# EAGLE design MySensors_PIR (EAGLE 7.2.0)
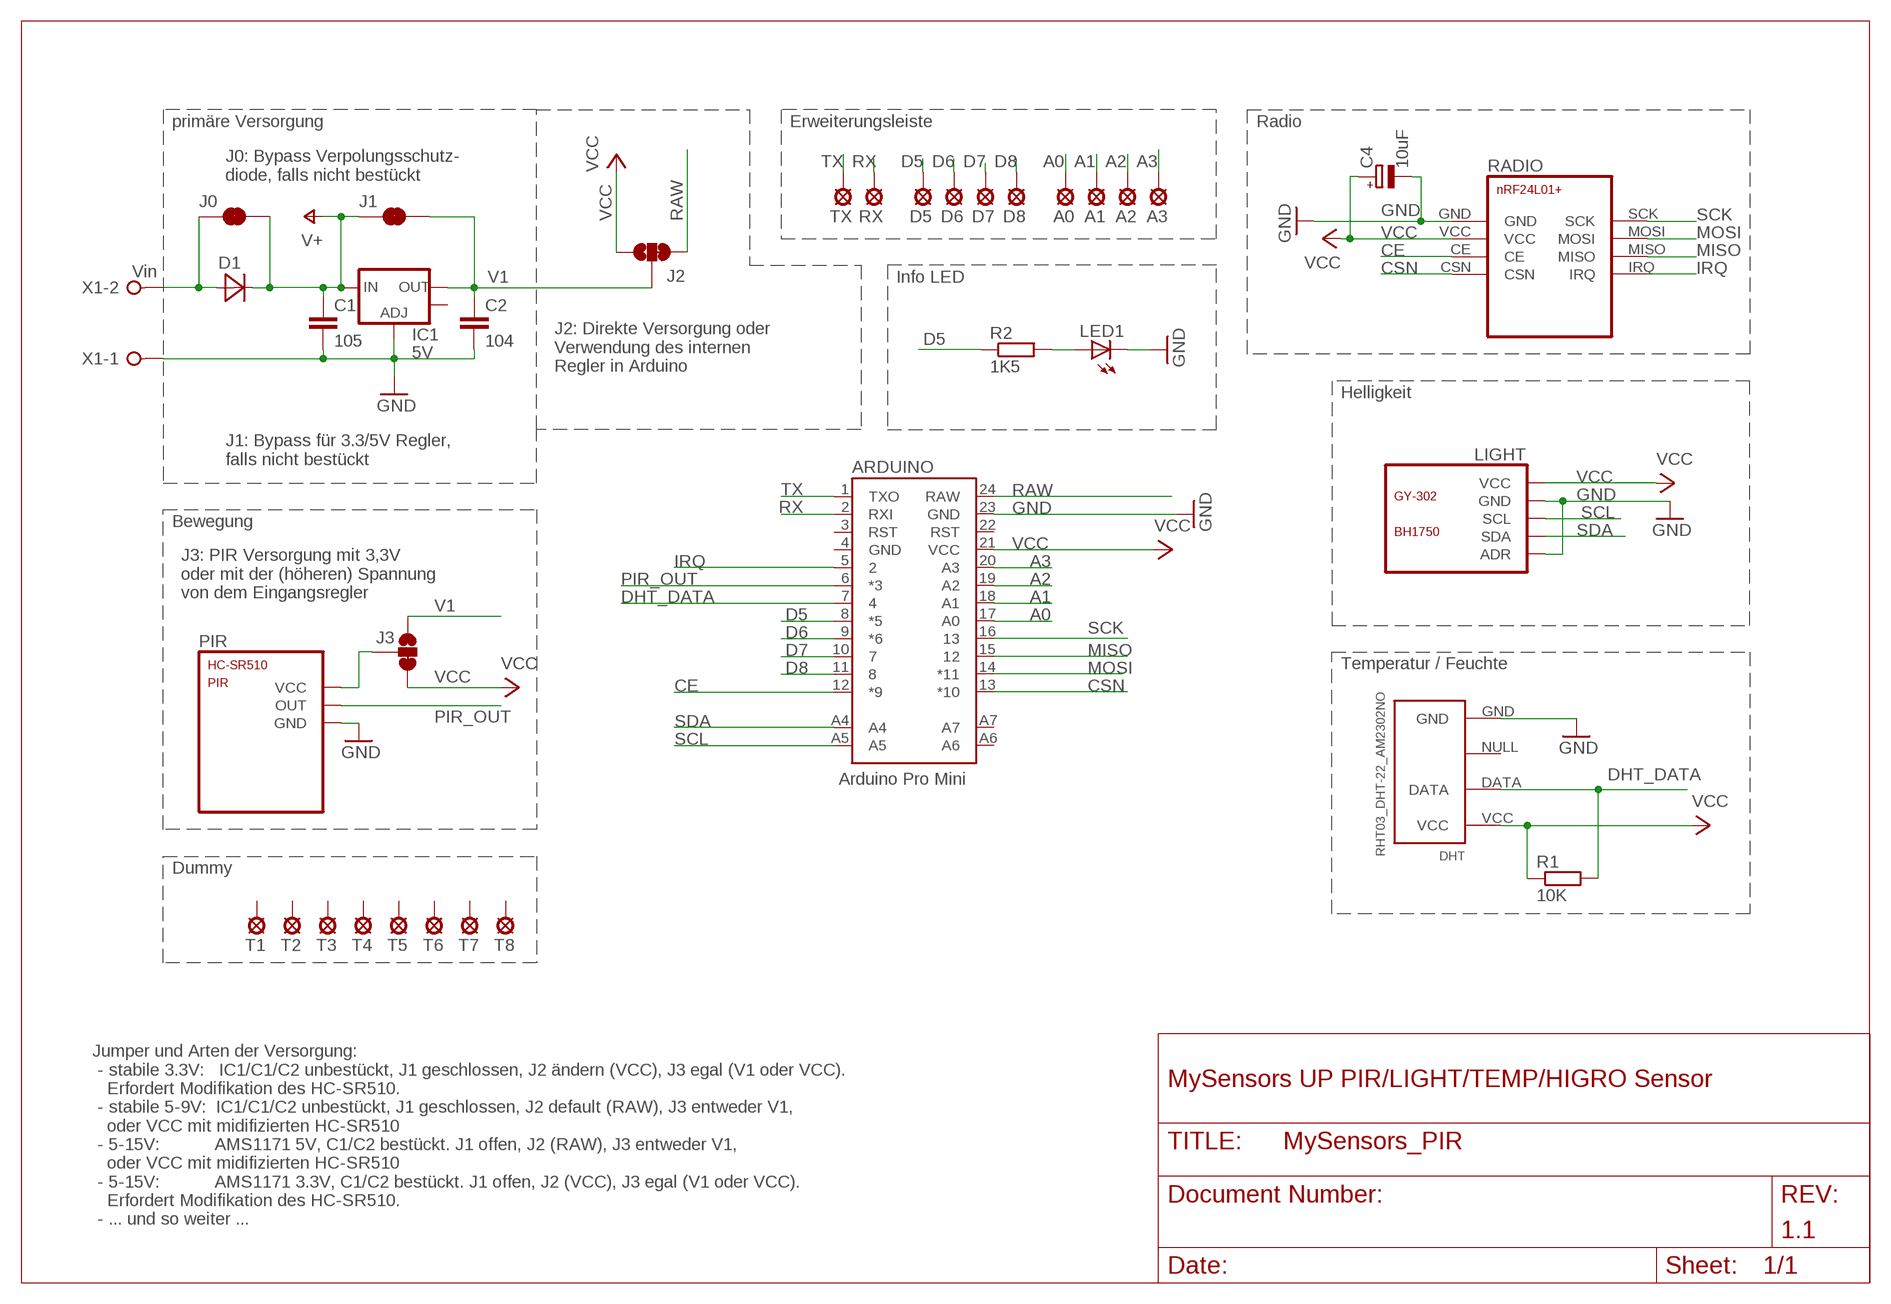
[diagram p0: schematic, sheet 1]

## Parts
A0  LSP10  [LSP10]
A1  LSP10  [LSP10]
A2  LSP10  [LSP10]
A3  LSP10  [LSP10]
ARDUINO  ARDUINO_PRO_MININO  [ARDUINO_PRO_MINI_O]
C1  105  C-EU025-025X050  [C025-025X050]
C2  104  C-EU025-025X050  [C025-025X050]
C4  10uF  CPOL-EUE2,5-6E  [E2,5-6E]
D1  DIODE2.5U  [DIODE2.5U]
D5  LSP10  [LSP10]
D6  LSP10  [LSP10]
D7  LSP10  [LSP10]
D8  LSP10  [LSP10]
DHT  RHT03_DHT-22_AM2302NO  [RHT03_DHT-22/RA_O]
IC1  5V  V_REG_LM1117SOT223  [SOT223]
J0  JUMPER-PAD-2-NC_BY_TRACE  [PAD-JUMPER-2-NC_BY_TRACE_YES_SILK]
J1  JUMPER-PAD-2-NC_BY_TRACE  [PAD-JUMPER-2-NC_BY_TRACE_YES_SILK]
J2  JUMPER-PAD-3-2OF3_NC_BY_TRACE_SMALL  [PAD-JUMPER-3-2OF3_NC_BY_TRACE_YES_SILK_FULL_BOX]
J3  JUMPER-PAD-3-2OF3_NC_BY_TRACE_SMALL  [PAD-JUMPER-3-2OF3_NC_BY_TRACE_YES_SILK_FULL_BOX]
LED1  UNI_LED_3MM+SMD  [LED3MM]
LIGHT  GY-302  [GY-302]
PIR  HC-SR501  [HC-SR501]
R1  10K  R-EU_0204/2V  [0204V]
R2  1K5  R-EU_0204/2V  [0204V]
RADIO  NRF24L01+  [NRF24L01+]
RX  LSP10  [LSP10]
T1  LSP10  [LSP10]
T2  LSP10  [LSP10]
T3  LSP10  [LSP10]
T4  LSP10  [LSP10]
T5  LSP10  [LSP10]
T6  LSP10  [LSP10]
T7  LSP10  [LSP10]
T8  LSP10  [LSP10]
TX  LSP10  [LSP10]
X1  Vin  W237-02P  [W237-132]

## Nets
A0: A0.1(MP) ARDUINO.17(A0)
A1: A1.1(MP) ARDUINO.18(A1)
A2: A2.1(MP) ARDUINO.19(A2)
A3: A3.1(MP) ARDUINO.20(A3)
CE: ARDUINO.12(*9) RADIO.CE
CSN: ARDUINO.13(*10) RADIO.CSN
D5: ARDUINO.8(*5) D5.1(MP) R2.1
D6: ARDUINO.9(*6) D6.1(MP)
D7: ARDUINO.10 D7.1(MP)
D8: ARDUINO.11 D8.1(MP)
DHT_DATA: ARDUINO.7 DHT.DATA R1.2
GND: ARDUINO.23(GND) C1.2 C2.2 C4.- DHT.GND IC1.1(ADJ) LED1.K(C) LIGHT.ADR LIGHT.GND PIR.GND RADIO.GND X1.1
IRQ: ARDUINO.5 RADIO.IRQ
MISO: ARDUINO.15 RADIO.MISO
MOSI: ARDUINO.14(*11) RADIO.MOSI
N$4: LED1.A R2.2
N$5: D1.A J0.1 X1.2
PIR_OUT: ARDUINO.6(*3) PIR.OUT
PIR_VCC: J3.2 PIR.VCC
RAW: ARDUINO.24(RAW) J2.3
RX: ARDUINO.2(RXI) RX.1(MP)
SCK: ARDUINO.16 RADIO.SCK
SCL: ARDUINO.A5 LIGHT.SCL
SDA: ARDUINO.A4 LIGHT.SDA
TX: ARDUINO.1(TXO) TX.1(MP)
V1: C2.1 IC1.2(OUT) J1.2 J2.2 J3.1
V+: C1.1 D1.K(C) IC1.3(IN) J0.2 J1.1
VCC: ARDUINO.21(VCC) C4.+ DHT.VCC J2.1 J3.3 LIGHT.VCC R1.1 RADIO.VCC
Unconnected: ARDUINO.3(RST) ARDUINO.4(GND) ARDUINO.22(RST) ARDUINO.A6 ARDUINO.A7 DHT.NULL IC1.4(OUT) T1.1(MP) T2.1(MP) T3.1(MP) T4.1(MP) T5.1(MP) T6.1(MP) T7.1(MP) T8.1(MP)

## Notes on the sheet
- primäre Versorgung | Erweiterungsleiste | Radio
- J0: Bypass Verpolungsschutz-
  diode, falls nicht bestückt
- Info LED
- J2: Direkte Versorgung oder 
  Verwendung des internen 
  Regler in Arduino
- Helligkeit
- J1: Bypass für 3.3/5V Regler, 
  falls nicht bestückt
- Bewegung
- J3: PIR Versorgung mit 3,3V 
  oder mit der (höheren) Spannung
  von dem Eingangsregler
- Temperatur / Feuchte
- Arduino Pro Mini
- Dummy
- MySensors UP PIR/LIGHT/TEMP/HIGRO Sensor
- Jumper und Arten der Versorgung:
   - stabile 3.3V:   IC1/C1/C2 unbestückt, J1 geschlossen, J2 ändern (VCC), J3 egal (V1 oder VCC). 
     Erfordert Modifikation des HC-SR510.
   - stabile 5-9V:  IC1/C1/C2 unbestückt, J1 geschlossen, J2 default (RAW), J3 entweder V1, 
     oder VCC mit midifizierten HC-SR510
   - 5-15V:           AMS1171 5V, C1/C2 bestückt. J1 offen, J2 (RAW), J3 entweder V1, 
     oder VCC mit midifizierten HC-SR510
   - 5-15V:           AMS1171 3.3V, C1/C2 bestückt. J1 offen, J2 (VCC), J3 egal (V1 oder VCC). 
     Erfordert Modifikation des HC-SR510.
   - ... und so weiter ...
- 1.1

## Library data of the parts
A0 A1-A3 D5-D8 RX T1-T8 TX = my:LSP10: SOLDER PAD drill 1.0 mm, distributor Buerklin, 12H555
ARDUINO = my:ARDUINO_PRO_MINI
C1 C2 = resistor:C-EU: CAPACITOR, European symbol
C4 = rcl:CPOL-EU: POLARIZED CAPACITOR, European symbol
D1 = my:DIODE2.5U
DHT = my:RHT03_DHT-22_AM2302: RHT03 / DHT-22 / AM2302 Packages and symbol for the RHT03 / DHT-22 relative humidity and temperature sensor. Note: The AM2302 is a wired version of the DHT-22 which typically requires less clearance and is thus provided as a separate package.
IC1 = SparkFun-PowerIC:V_REG_LM1117: Voltage Regulator LM1117 Standard adjustable voltage regulator but in SMD form. Spark Fun Electronics SKU : COM-00595; PROD_ID: VREG-08170
J0 J1 = SparkFun-Passives:JUMPER-PAD-2-NC_BY_TRACE
J2 J3 = SparkFun-Passives:JUMPER-PAD-3-2OF3_NC_BY_TRACE
LED1 = my:UNI_LED_3MM+SMD: Low Current (2mA) LED 3 mm Tinted Diffused Package color RED Source: Data sheet <http://www.farnell.com/datasheets/391100.pdf>
LIGHT = my:GY-302: GY-302 / BH1750
PIR = my:HC-SR501: PIR Module HC-SR501
R1 R2 = resistor:R-EU_: RESISTOR, European symbol
RADIO = my:NRF24L01+: nRF24L01+ Transceiver Module
X1 = con-wago-508:W237-02P: WAGO SREW CLAMP; OC_FARNELL: unknown; OC_NEWARK: unknown

## Board
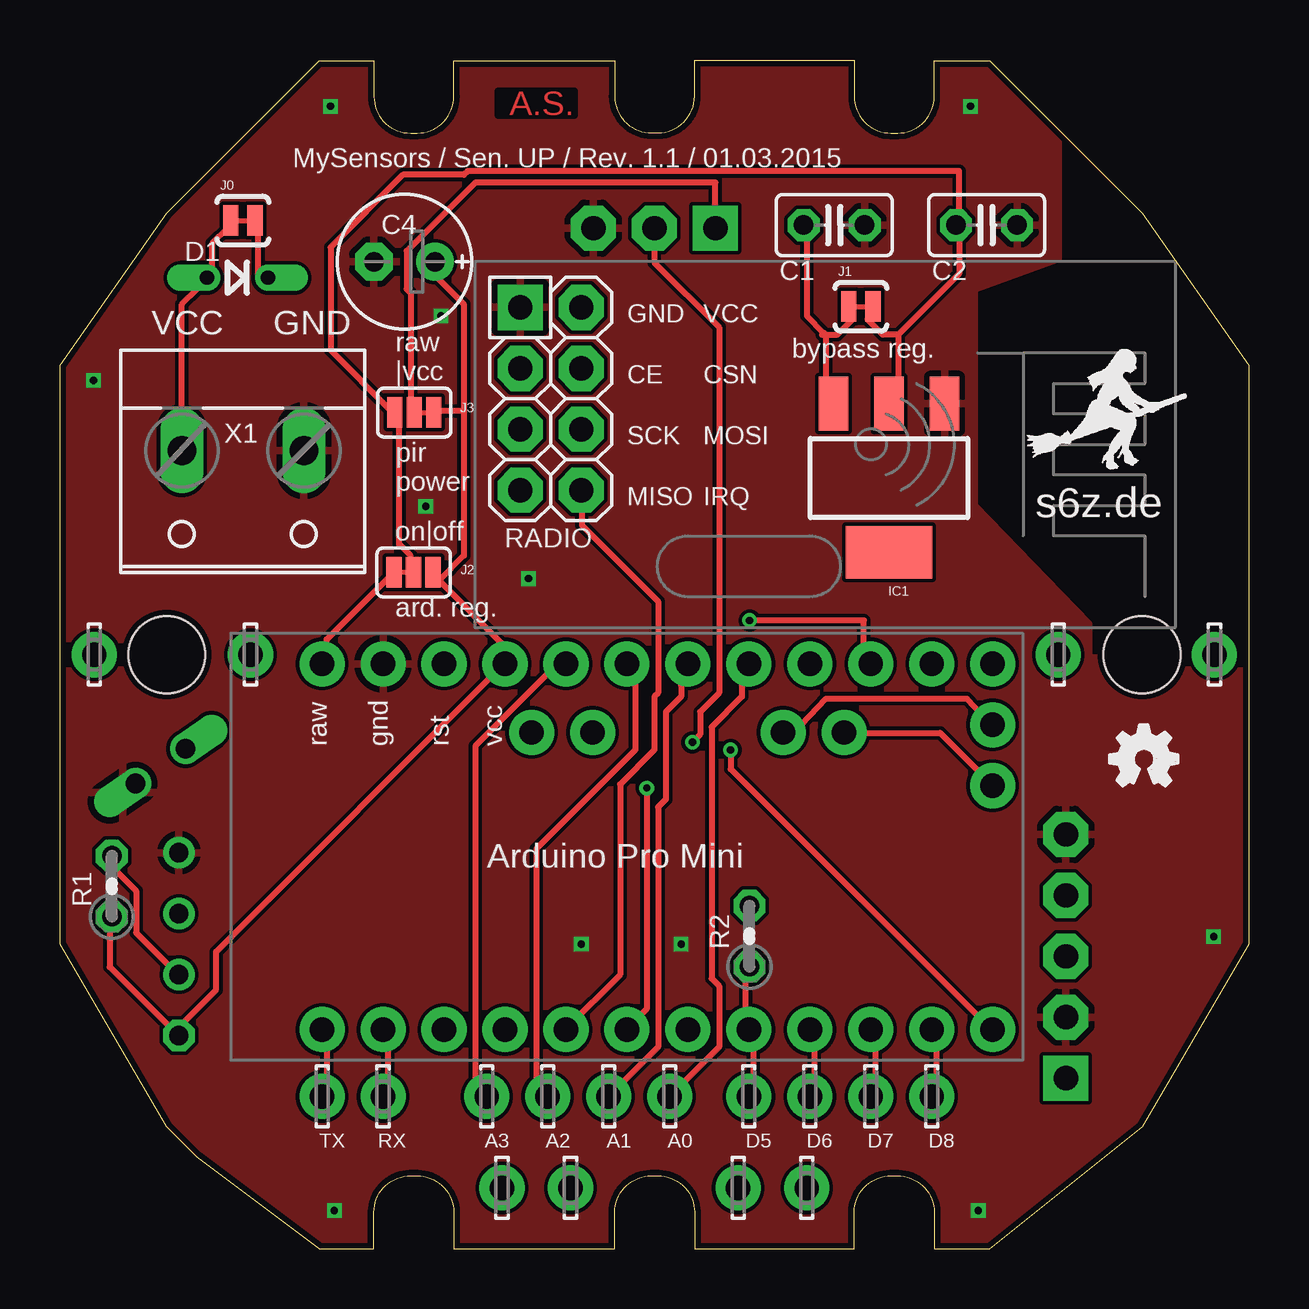
[diagram p1: board, top side]
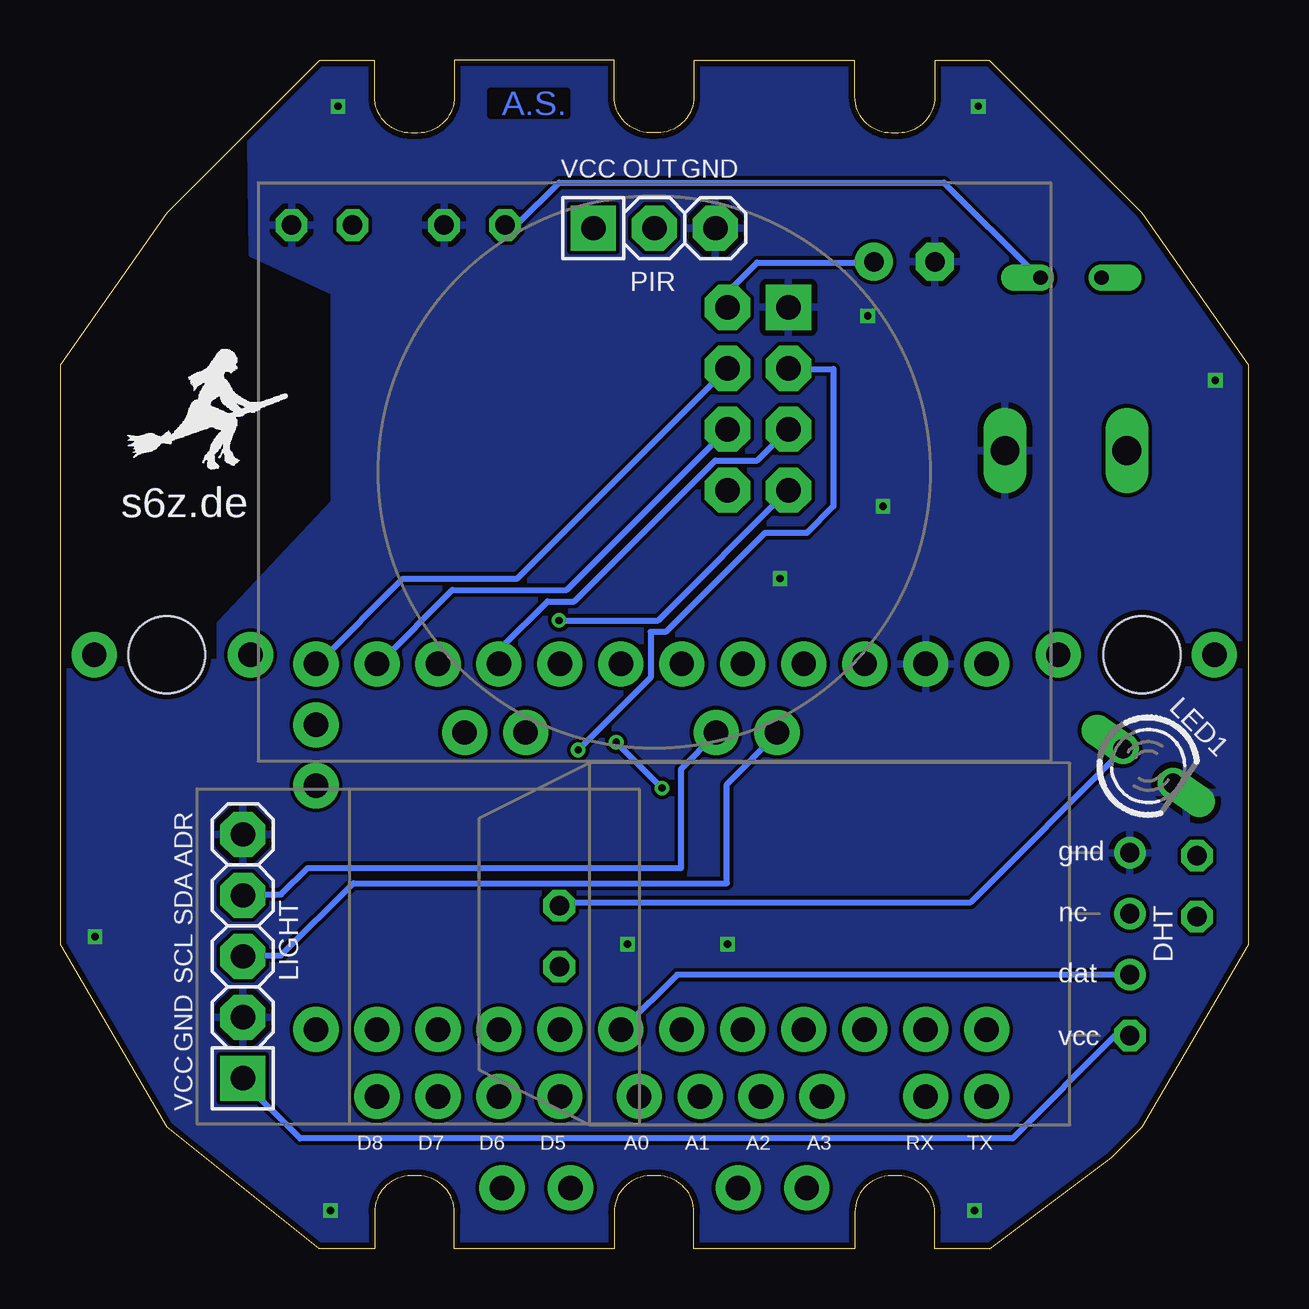
[diagram p2: board, bottom side, seen from below]

Size 49.53 x 49.56 mm. Coordinates in mm from the lower left corner, seen from the top.
Outline: 10.8,0 13.08,0 13.08,1.52 arc-90 14.61,3.05 14.88,3.05 arc-90 16.41,1.52 16.41,0 23.11,0 23.11,1.52 arc-90 24.64,3.05 24.92,3.05 arc-90 26.44,1.52 26.44,0 33.1,0 33.1,1.52 arc-90 34.62,3.05 34.9,3.05 arc-90 36.42,1.52 36.42,0 38.73,0 45.09,5.08 49.53,12.7 49.53,36.83 45.09,43.18 38.73,49.53 36.42,49.53 36.42,48.03 arc-90 34.9,46.51 34.62,46.51 arc-90 33.1,48.03 33.1,49.55 26.44,49.55 26.44,48.04 arc-90 24.93,46.52 24.65,46.52 arc-90 23.11,48.04 23.11,49.53 16.41,49.53 16.41,48.03 arc-90 14.88,46.51 14.61,46.51 arc-90 13.08,48.03 13.08,49.53 10.8,49.53 4.45,43.18 0,36.83 0,12.7 4.45,5.08 5.72,3.81 10.8,0
Copper layers (1*16): Top 0.035mm / dielectric 1.5mm / Bottom 0.035mm
Design rules "ITEADstudio_DRC": minimum track width 6mil, minimum drill 12mil, track to track 6mil, track to pad 6mil, pad to pad 6mil, via to via 6mil, smd to smd 0mil, copper to edge 10mil, drill to drill 10mil, minimum pad ring 10mil, minimum via ring 6mil, stop-mask expansion 2mil, vias tented up to drill 100mil, thermal gap 10mil
Holes 3.2 mm at 4.45,24.77 45.09,24.77

### Footprints (pad centres in the part's own frame; a part is rotated, then mirrored left to right if it is on the bottom)
LSP10 = drill 1.016 pad 1.88: 1 0,0
ARDUINO_PRO_MINI_O = drill 1.016 pad 1.88: 1 -7.62,12.7; 2 -7.62,10.16; 3 -7.62,7.62; 4 -7.62,5.08; 5 -7.62,2.54; 6 -7.62,0; 7 -7.62,-2.54; 8 -7.62,-5.08; 9 -7.62,-7.62; 10 -7.62,-10.16; 11 -7.62,-12.7; 12 -7.62,-15.24; 13 7.62,-15.24; 14 7.62,-12.7; 15 7.62,-10.16; 16 7.62,-7.62; 17 7.62,-5.08; 18 7.62,-2.54; 19 7.62,0; 20 7.62,2.54; 21 7.62,5.08; 22 7.62,7.62; 23 7.62,10.16; 24 7.62,12.7; A4 4.763,1.429; A5 4.763,3.969; A6 4.763,-9.049; A6@1 2.54,-15.24; A7 4.763,-6.509; A7@1 5.08,-15.24
C025-025X050 = drill 0.813 octagon: 1 -1.27,0; 2 1.27,0
E2,5-6E = drill 0.813 pad 1.575: + -1.27,0 | drill 0.813 pad 1.575 octagon: - 1.27,0
DIODE2.5U = drill 0.6 offset: A -1.333,0; K 1.206,0
RHT03_DHT-22/RA_O = drill 0.8: DATA -1.27,-6.35; GND 3.81,-6.35; NULL 1.27,-6.35 | drill 0.8 octagon: VCC -3.81,-6.35
SOT223 = smd 1.219 x 2.235: 1 -2.311,-3.099; 2 0,-3.099; 3 2.311,-3.099 | smd 3.6 x 2.2: 4 0,3.099
PAD-JUMPER-2-NC_BY_TRACE_YES_SILK = smd 0.635 x 1.27: 1 -0.508,0; 2 0.508,0
PAD-JUMPER-3-2OF3_NC_BY_TRACE_YES_SILK_FULL_BOX = smd 0.635 x 1.27: 1 -0.813,0; 2 0,0; 3 0.813,0
LED3MM = drill 0.813 offset: A -0.381,0; K 2.159,0
GY-302 = drill 1.016 pad 1.88 octagon: ADR 0,1.905; GND -7.62,1.905; SCL -5.08,1.905; SDA -2.54,1.905 | drill 1.016 pad 1.88 square: VCC -10.16,1.905
HC-SR501 = drill 1.016 pad 1.88 octagon: GND 2.54,10.795; OUT 0,10.795 | drill 1.016 pad 1.88 square: VCC -2.54,10.795
0204V = drill 0.813 octagon: 1 -1.27,0; 2 1.27,0
NRF24L01+ = drill 1.016 pad 1.88 octagon: CE -11.43,1.27; CSN -8.89,1.27; IRQ -8.89,-3.81; MISO -11.43,-3.81; MOSI -8.89,-1.27; SCK -11.43,-1.27; VCC -8.89,3.81 | drill 1.016 pad 1.88 square: GND -11.43,3.81
W237-132 = drill 1.194 long: 1 -2.54,-0.635; 2 2.54,-0.635

### Placement (x,y rotation side)
A0  25.4,6.35 90 top
A1  22.86,6.35 90 top
A2  20.32,6.35 90 top
A3  17.78,6.35 90 top
ARDUINO  23.62,16.76 90 top
C1  32.26,42.67 0 top
C2  38.61,42.67 0 top
C4  14.35,41.15 180 top
D1  7.46,40.48 0 top
D5  28.7,6.35 90 top
D6  31.24,6.35 90 top
D7  33.78,6.35 90 top
D8  36.32,6.35 90 top
DHT  11.3,12.7 90 bottom
IC1  34.54,32.13 180 top
J0  7.62,42.86 0 top
J1  33.37,39.27 0 top
J2  14.73,28.19 180 top
J3  14.76,34.86 0 top
LED1  4.92,20.64 325 bottom
LIGHT  40.01,17.27 90 bottom
PIR  24.77,31.75 0 bottom
R1  2.16,15.11 90 top
R2  28.73,13.03 90 top
RADIO  30.61,35.43 0 top
RX  13.46,6.35 90 top
T1  7.94,24.77 90 top
T2  41.59,24.77 90 top
T3  18.41,2.54 90 top
T4  21.27,2.54 90 top
T5  28.26,2.54 90 top
T6  31.11,2.54 90 top
T7  1.43,24.77 90 top
T8  48.1,24.77 90 top
TX  10.92,6.35 90 top
U$2  [OSHW_FILLX100_NOTEXT]  43.75,19.3 0 top
X1  7.62,32.64 180 top

### Tracks (layer width: path | path; a pad name or v marks a point on that pad's centre or on a via)
A0
  Top 0.254: A0.1 27.46,8.41 27.46,10.95 27.15,11.27 27.15,21.75 28.42,23.02 28.42,23.5 28.57,23.65 28.57,24.29 ARDUINO.17
A1
  Top 0.254: A1.1 24.92,8.41 24.92,18.41 25.24,18.73 25.24,22.38 25.88,23.02 25.88,23.5 26.04,23.65 26.04,24.29 ARDUINO.18
A2
  Top 0.254: A2.1 19.84,6.83 19.84,16.67 23.97,20.8 23.97,23.5 23.65,23.81 23.65,24.29 ARDUINO.19
A3
  Top 0.254: A3.1 17.3,6.83 17.3,20.95 20.64,24.29 20.95,24.29 ARDUINO.20
CE  (via drill 0.3)
  Top 0.254: v27.94,20.8 27.94,20 38.73,9.21 ARDUINO.12
  Bottom 0.254: v27.94,20.8 24.92,23.81 24.92,25.72 24.29,25.72 20.16,29.84 18.41,29.84 17.3,30.96 17.3,36.67 19.05,36.67 RADIO.CE
CSN
  Bottom 0.254: RADIO.CSN 30.48,27.94 35.24,27.94 38.73,24.45 ARDUINO.13
D5
  Top 0.254: R2.1 28.57,11.75 28.57,9.21 ARDUINO.8 28.73,9.05 28.89,8.89 28.89,6.51 28.73,6.35 D5.1
D6
  Top 0.254: D6.1 31.27,6.35 31.43,6.51 31.43,8.89 31.27,9.05 ARDUINO.9
D7
  Top 0.254: D7.1 33.81,6.35 33.97,6.51 33.97,8.89 33.81,9.05 ARDUINO.10
D8
  Top 0.254: D8.1 36.35,6.35 36.51,6.51 36.51,8.89 36.35,9.05 ARDUINO.11
DHT_DATA
  Top 0.254: DHT.DATA 4.92,11.43 3.17,13.18 3.17,14.92 2.22,15.88 2.22,16.35 R1.2
  Bottom 0.254: DHT.DATA 23.81,11.43 26.04,9.21 ARDUINO.7
GND  (via drill 0.3)
  other vias: 21.72,12.7 11.27,47.63 11.43,1.6 38.26,1.6 25.88,12.7 15.24,30.96 15.88,38.89 37.94,47.63 48.07,13.02 1.4,36.2 19.53,27.94
  pour Top: -0.76,12.32 -0.32,37.4 0.32,38.42 4.13,44.45 11.75,50.61 39.31,50.48 41.59,47.31 41.59,41.27 38.1,40.01 38.1,30.99 42.86,26.04 42.86,24.64 50.55,24.64 50.55,12.19 44.7,3.49 37.85,-1.27 11.49,-0.89 4.38,4.25 -0.76,12.19
  pour Bottom: -0.63,12.7 -0.38,37.47 4.19,44.7 11.56,50.55 39.12,50.67 41.59,47.18 41.59,46.04 41.53,41.47 38.1,39.88 38.1,31.12 42.86,26.04 42.86,24.45 50.48,24.77 50.42,12.07 45.34,4.19 37.97,-1.02 11.43,-0.76 4.45,4.06 -0.51,12.57
IRQ
  Top 0.254: ARDUINO.5 21.11,9.21 23.34,11.43 23.34,19.37 24.77,20.8 24.77,23.02 24.92,23.18 24.92,26.99 21.75,30.16 21.75,31.59 RADIO.IRQ
MISO  (via drill 0.3)
  Top 0.254: v28.73,26.19 33.5,26.19 33.5,24.61 33.66,24.45 ARDUINO.15
  Bottom 0.254: RADIO.MISO 24.61,26.19 v28.73,26.19
MOSI
  Bottom 0.254: RADIO.MOSI 28.42,27.46 33.18,27.46 36.2,24.45 ARDUINO.14
N$4
  Bottom 0.254: LED1.A 5.24,20.8 11.59,14.45 28.57,14.45 R2.2
N$5
  Top 0.152: 6.99,42.54 J0.1 | 6.35,40.64 D1.A 5.72,40.01
  Top 0.254: 6.99,42.54 6.35,41.91 6.35,40.64 | 5.72,40.01 5.08,39.37 X1.2
N$6
  Top 0.254: 30.16,21.51 30.56,21.51 31.91,22.94 37.78,22.94 38.81,21.83
N$7
  Top 0.254: 32.7,21.51 36.67,21.51 38.89,19.29
PIR_OUT  (via drill 0.3)
  Top 0.254: v24.45,19.21 24.45,10 23.65,9.21 ARDUINO.6 | v26.35,21.11 26.67,21.43 26.67,22.38 27.46,23.18 27.46,38.42 24.77,41.12 PIR.OUT
  Bottom 0.254: v26.35,21.11 v24.45,19.21
PIR_VCC
  Top 0.254: PIR.VCC 27.3,44.45 17.3,44.45 14.45,41.59 14.45,40.01 14.61,39.85 14.61,35.08 14.76,34.93 J3.2
RAW
  Top 0.254: J2.3 13.65,27.94 11.11,25.4 11.11,24.45 ARDUINO.24
RX
  Top 0.254: RX.1 13.49,6.35 13.65,6.51 13.65,8.89 13.49,9.05 ARDUINO.2
SCK
  Bottom 0.254: RADIO.SCK 20.48,32.86 22.22,32.86 28.1,26.99 29.21,26.99 31.11,25.08 31.11,24.45 ARDUINO.16
SCL
  Bottom 0.254: ARDUINO.A5 19.68,21.43 21.75,19.37 21.75,15.24 37.31,15.24 40.32,12.22 41.91,12.22 LIGHT.SCL
SDA
  Bottom 0.254: ARDUINO.A4 22.22,21.43 23.65,20 23.65,15.88 39.21,15.88 40.32,14.76 41.91,14.76 LIGHT.SDA
TX
  Top 0.254: TX.1 10.95,6.35 11.11,6.51 11.11,8.89 10.95,9.05 ARDUINO.1
V1
  Top 0.254: J2.2 14.61,28.26 14.61,28.89 14.13,29.37 14.13,34.61 13.97,34.77 J3.1 13.81,34.93 11.27,37.47 11.27,41.75 14.29,44.77 16.83,44.77 16.99,44.93 37.47,44.93 37.47,42.7 C2.1 37.47,42.54 37.47,40.64 34.93,38.1 | 34.93,38.1 34.93,35.56 34.61,35.24 IC1.2 | 34.93,38.1 34.29,38.1 33.66,38.74 J1.2
V+
  Top 0.152: 8.25,42.54 J0.2 | 8.25,40.64 D1.K
  Top 0.254: 31.83,38.18 31.11,38.89 31.11,42.54 C1.1 | 31.83,38.18 31.91,38.1 31.91,35.56 32.23,35.24 IC1.3 | J1.1 33.02,38.74 32.39,38.1 31.75,38.1 31.83,38.18 | 8.25,40.64 8.25,42.54
  Bottom 0.152: 8.89,40.64 D1.K
  Bottom 0.254: C1.1 30.96,42.7 30.48,42.7 28.73,44.45 12.7,44.45 8.89,40.64
VCC
  Top 0.254: 15.8,27.86 18.41,25.24 18.41,24.45 ARDUINO.21 18.41,24.29 6.51,12.38 6.51,10.8 4.92,9.21 4.92,9.05 DHT.VCC 4.92,8.89 2.06,11.75 2.06,13.81 R1.1 | 15.8,27.86 15.56,28.1 J2.1 | 15.8,27.86 16.83,28.89 16.83,34.93 | 16.83,34.93 16.83,39.37 15.72,40.48 15.72,41.12 C4.+ | 16.83,34.93 15.88,34.93 J3.3
  Bottom 0.254: C4.+ 15.72,41.12 20.48,41.12 21.59,40.01 21.59,39.37 RADIO.VCC | DHT.VCC 5.56,8.89 9.84,4.6 39.53,4.6 41.91,6.98 LIGHT.VCC

### Text on the board
Top: A.S.
Bottom: A.S.
tPlace: MySensors / Sen. UP / Rev. 1.1 / 01.03.2015 | VCC | GND | bypass reg. | raw / |vcc | pir / power | s6z.de | on|off | ard. reg. | raw | gnd | rst | vcc | Arduino Pro Mini
bPlace: s6z.de | gnd | nc | dat | vcc | TX | RX | A3 | A2 | A1 | A0 | D5 | D6 | D7 | D8